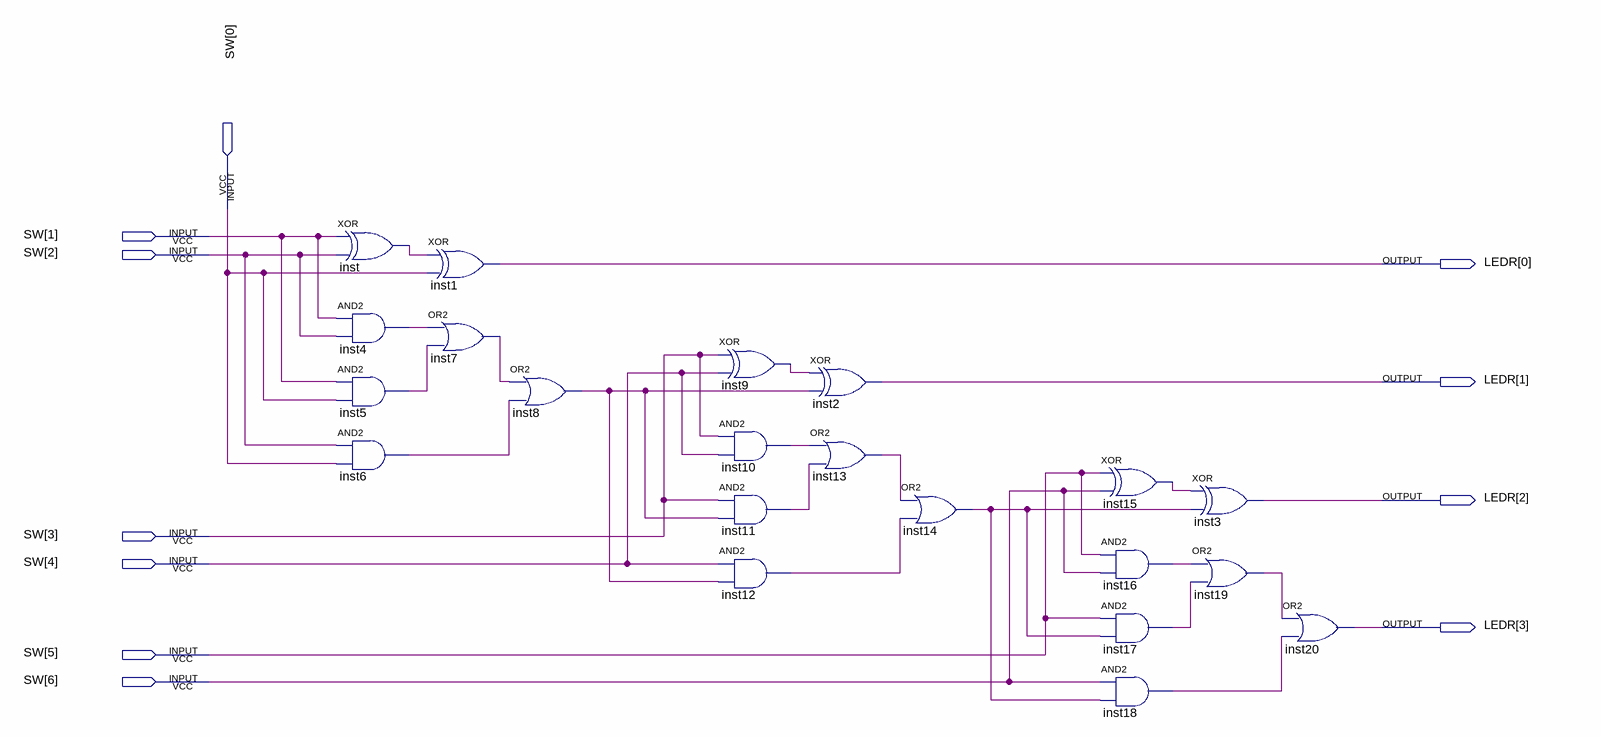
[diagram p0: schematic sheet]
// Quartus schematic AdderWithDisplay.bdf as structural Verilog: 21 symbols, 11 pins
module AdderWithDisplay (
  input  [6:0] SW,
  output [3:0] LEDR
);

  wire inst4_out, inst5_out, inst6_out, inst7_out, inst8_out, inst9_out, inst10_out, inst11_out, inst12_out,
       inst13_out, inst14_out, inst15_out, inst16_out, inst17_out, inst18_out, inst19_out, inst_out;

  xor inst (inst_out, SW[1], SW[2]);
  and inst4 (inst4_out, SW[1], SW[2]);
  and inst5 (inst5_out, SW[1], SW[0]);
  and inst6 (inst6_out, SW[2], SW[0]);
  xor inst1 (LEDR[0], inst_out, SW[0]);
  or inst7 (inst7_out, inst4_out, inst5_out);
  or inst8 (inst8_out, inst7_out, inst6_out);
  xor inst9 (inst9_out, SW[3], SW[4]);
  and inst10 (inst10_out, SW[3], SW[4]);
  and inst11 (inst11_out, SW[3], inst8_out);
  and inst12 (inst12_out, SW[4], inst8_out);
  xor inst2 (LEDR[1], inst9_out, inst8_out);
  or inst13 (inst13_out, inst10_out, inst11_out);
  or inst14 (inst14_out, inst13_out, inst12_out);
  xor inst15 (inst15_out, SW[5], SW[6]);
  and inst16 (inst16_out, SW[5], SW[6]);
  and inst17 (inst17_out, SW[5], inst14_out);
  and inst18 (inst18_out, SW[6], inst14_out);
  xor inst3 (LEDR[2], inst15_out, inst14_out);
  or inst19 (inst19_out, inst16_out, inst17_out);
  or inst20 (LEDR[3], inst19_out, inst18_out);
endmodule
